# EAGLE schematic controller11_2 (EAGLE 9.4.1)

## Sheet 1 of 2
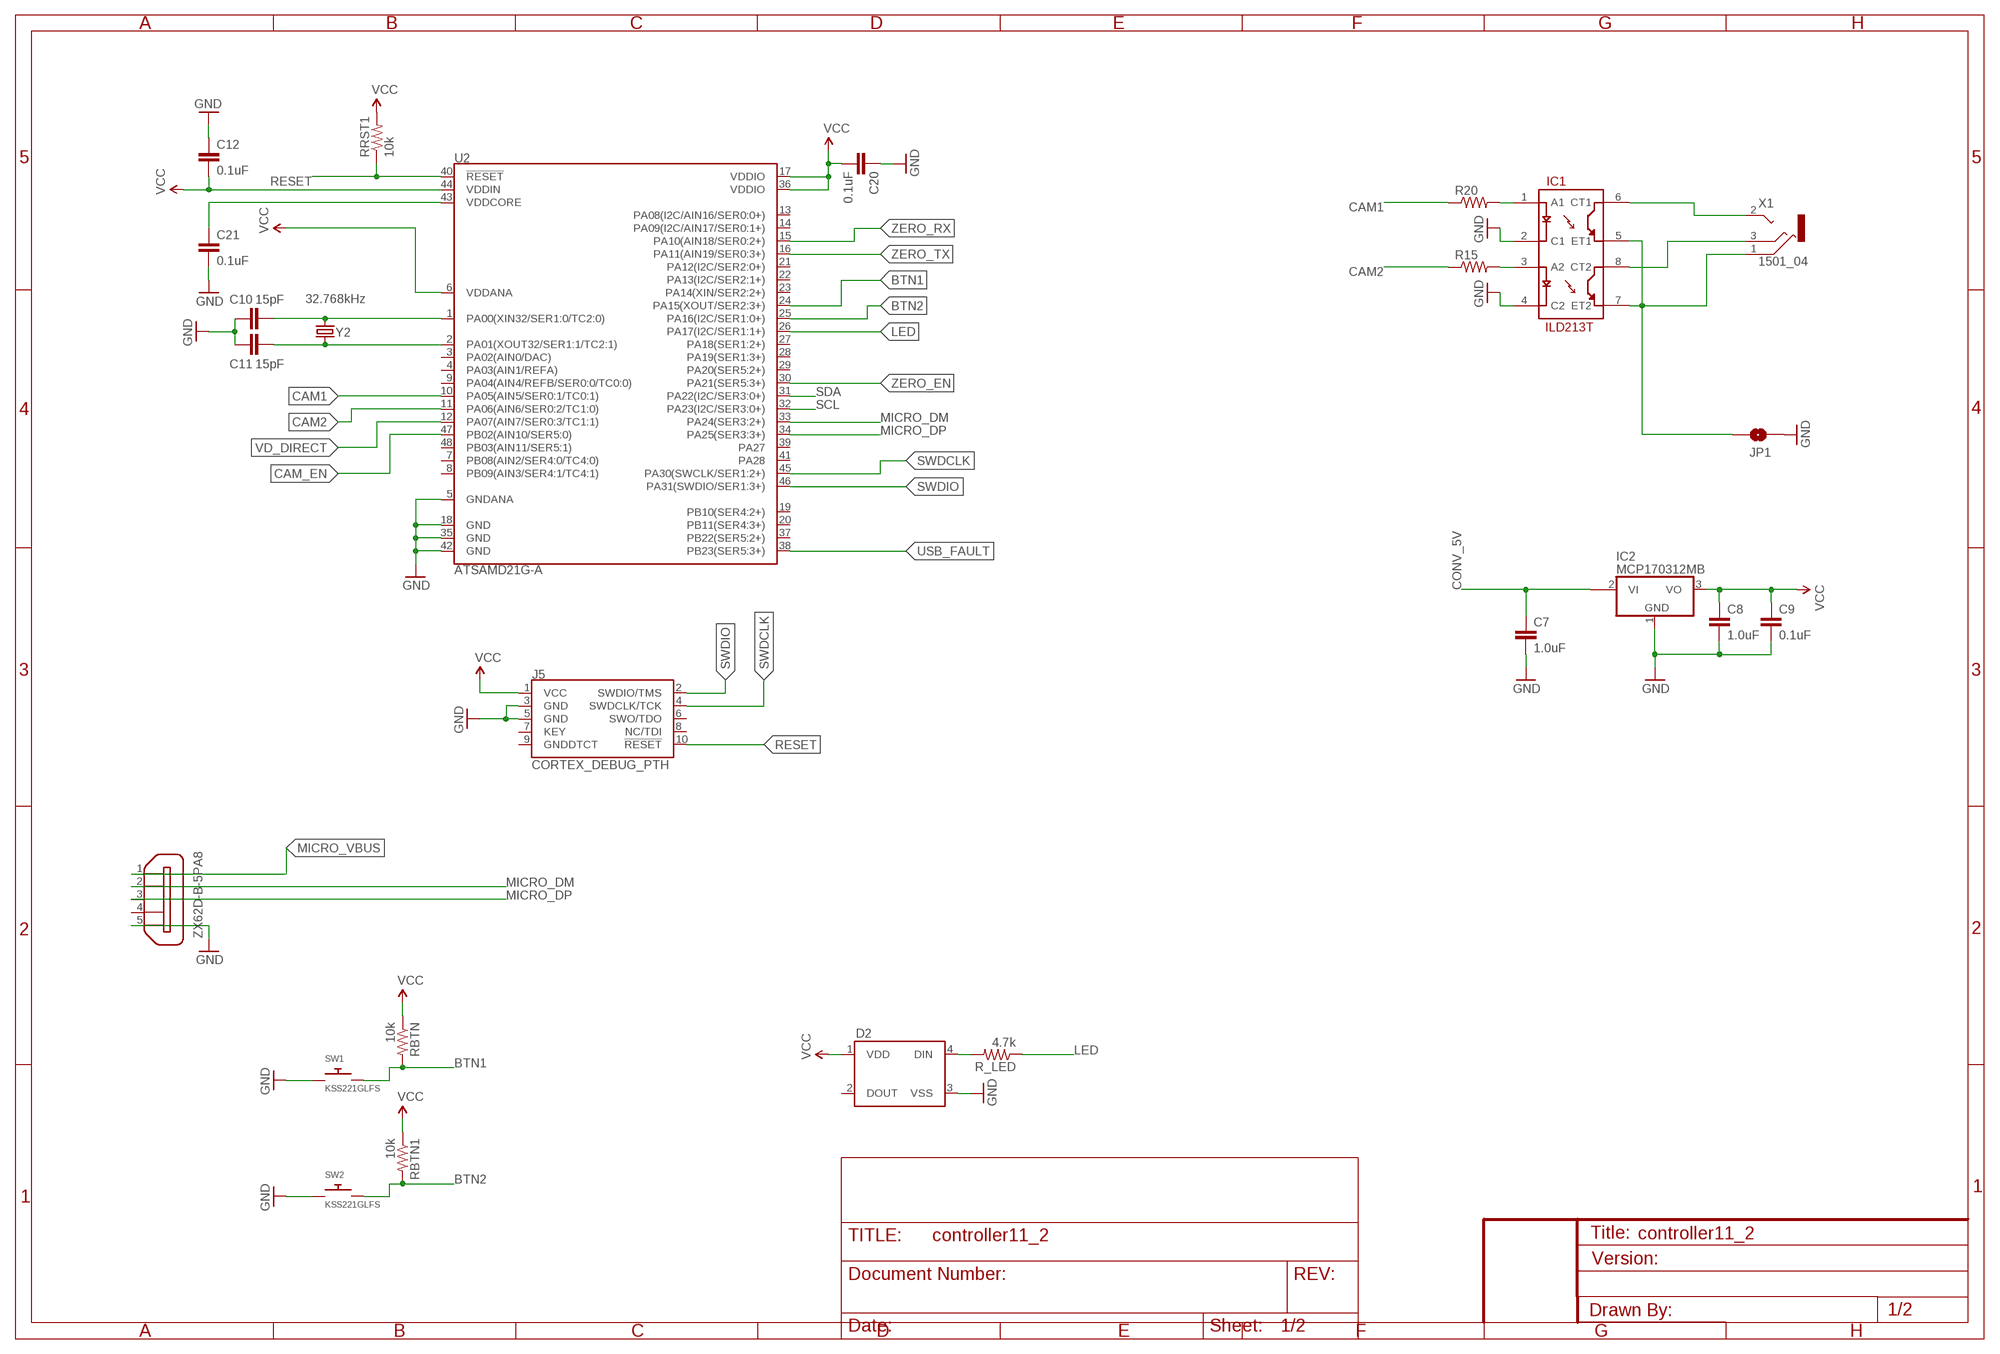
[diagram p0: schematic, sheet 1]

### Parts
C7  1.0uF  1.0UF-0805-25V-10%  [0805]
C8  1.0uF  1.0UF-1206-50V-10%  [1206]
C9  0.1uF  1.0UF-0805-25V-10%  [0805]
C10  15pF  CAP0805  [0805]
C11  15pF  CAP0805  [0805]
C12  0.1uF  1.0UF-0805-25V-10%  [0805]
C20  0.1uF  1.0UF-0805-25V-10%  [0805]
C21  0.1uF  1.0UF-0805-25V-10%  [0805]
D2  WS2812B  [WS2812B]
IC1  ILD213T  [SO08]
IC2  MCP170312MB  [SOT89]
J5  CORTEX_DEBUG_PTH  [2X5-PTH-1.27MM]
JP1  JUMPER-PAD-2-NOYES_SILK  [PAD-JUMPER-2-NO_YES_SILK]
R15  RESISTOR0805-RES  [0805]
R20  RESISTOR0805-RES  [0805]
R_LED  4.7k  RESISTOR0805-RES  [0805]
RBTN  10k  RESISTOR0805-RES  [0805]
RBTN1  10k  RESISTOR0805-RES  [0805]
RRST1  10k  RESISTOR0805-RES  [0805]
SW1  KSS221GLFS  SWITCH_PUSHBUTTONC&K_KSS  [BTN_CK_KSS]
SW2  KSS221GLFS  SWITCH_PUSHBUTTONC&K_KSS  [BTN_CK_KSS]
U2  ATSAMD21G-A  [TQFP-48]
X1  1501_04  [1501_05]
X2  ZX62D-B-5PA8  [ZX62D-B-5PA8]
Y2  32.768kHz  CRYSTAL3.2X1.5MM  [CRYSTAL-SMD-3.2X1.5MM]

### Nets
BTN1: RBTN.2 SW1.P$2 U2.24(PA15(XOUT/SER2:3+))
BTN2: RBTN1.2 SW2.P$2 U2.25(PA16(I2C/SER1:0+))
CAM1: R20.1 U2.10(PA05(AIN5/SER0:1/TC0:1))
CAM2: R15.1 U2.11(PA06(AIN6/SER0:2/TC1:0))
CAM_EN: U2.47(PB02(AIN10/SER5:0)) ; also sheet 2
CONV_5V [power]: C7.1 IC2.2@1(VI1) ; also sheet 2
GND: C7.2 C8.2 C9.2 C10.1 C11.1 C12.1 C20.1 C21.2 D2.3(VSS) IC1.2(C1) IC1.4(C2) IC2.1(GND) J5.3(GND) J5.5(GND) JP1.1 SW1.P$1 SW2.P$1 U2.5(GNDANA) U2.18(GND) U2.35(GND) U2.42(GND) X2.5 ; also sheet 2
LED: R_LED.1 U2.26(PA17(I2C/SER1:1+))
MICRO_DM: U2.33(PA24(SER3:2+)) X2.2
MICRO_DP: U2.34(PA25(SER3:3+)) X2.3
MICRO_VBUS: X2.1
N$2: C21.1 U2.43(VDDCORE)
N$3: C10.2 U2.1(PA00(XIN32/SER1:0/TC2:0)) Y2.P$2
N$7: D2.4(DIN) R_LED.2
N$12: IC1.6(CT1) X1.2
N$13: IC1.8(CT2) X1.3
N$15: IC1.3(A2) R15.2
N$19: IC1.1(A1) R20.2
N$32: C11.2 U2.2(PA01(XOUT32/SER1:1/TC2:1)) Y2.P$1
N$34: IC1.5(ET1) IC1.7(ET2) JP1.2 X1.1
RESET: J5.10(!RESET) RRST1.1 U2.40(!RESET!)
SCL: U2.32(PA23(I2C/SER3:0+)) ; also sheet 2
SDA: U2.31(PA22(I2C/SER3:0+)) ; also sheet 2
SWDCLK: J5.4(SWDCLK/TCK) U2.45(PA30(SWCLK/SER1:2+))
SWDIO: J5.2(SWDIO/TMS) U2.46(PA31(SWDIO/SER1:3+))
USB_FAULT: U2.38(PB23(SER5:3+))
VCC [power]: C8.1 C9.1 C12.2 C20.2 D2.1(VDD) IC2.3(VO) J5.1(VCC) RBTN1.1 RBTN.1 RRST1.2 U2.6(VDDANA) U2.17(VDDIO) U2.36(VDDIO) U2.44(VDDIN) ; also sheet 2
VD_DIRECT: U2.12(PA07(AIN7/SER0:3/TC1:1)) ; also sheet 2
ZERO_EN: U2.30(PA21(SER5:3+)) ; also sheet 2
ZERO_RX [tiny]: U2.15(PA10(AIN18/SER0:2+)) ; also sheet 2
ZERO_TX [tiny]: U2.16(PA11(AIN19/SER0:3+)) ; also sheet 2
Unconnected: D2.2(DOUT) IC2.2(VI) J5.6(SWO/TDO) J5.7(KEY) J5.8(NC/TDI) J5.9(GNDDTCT) U2.3(PA02(AIN0/DAC)) U2.4(PA03(AIN1/REFA)) U2.7(PB08(AIN2/SER4:0/TC4:0)) U2.8(PB09(AIN3/SER4:1/TC4:1)) U2.9(PA04(AIN4/REFB/SER0:0/TC0:0)) U2.13(PA08(I2C/AIN16/SER0:0+)) U2.14(PA09(I2C/AIN17/SER0:1+)) U2.19(PB10(SER4:2+)) U2.20(PB11(SER4:3+)) U2.21(PA12(I2C/SER2:0+)) U2.22(PA13(I2C/SER2:1+)) U2.23(PA14(XIN/SER2:2+)) U2.27(PA18(SER1:2+)) U2.28(PA19(SER1:3+)) U2.29(PA20(SER5:2+)) U2.37(PB22(SER5:2+)) U2.39(PA27) U2.41(PA28) U2.48(PB03(AIN11/SER5:1)) X2.4 X2.S1 X2.S2 X2.S3 X2.S4

## Sheet 2 of 2
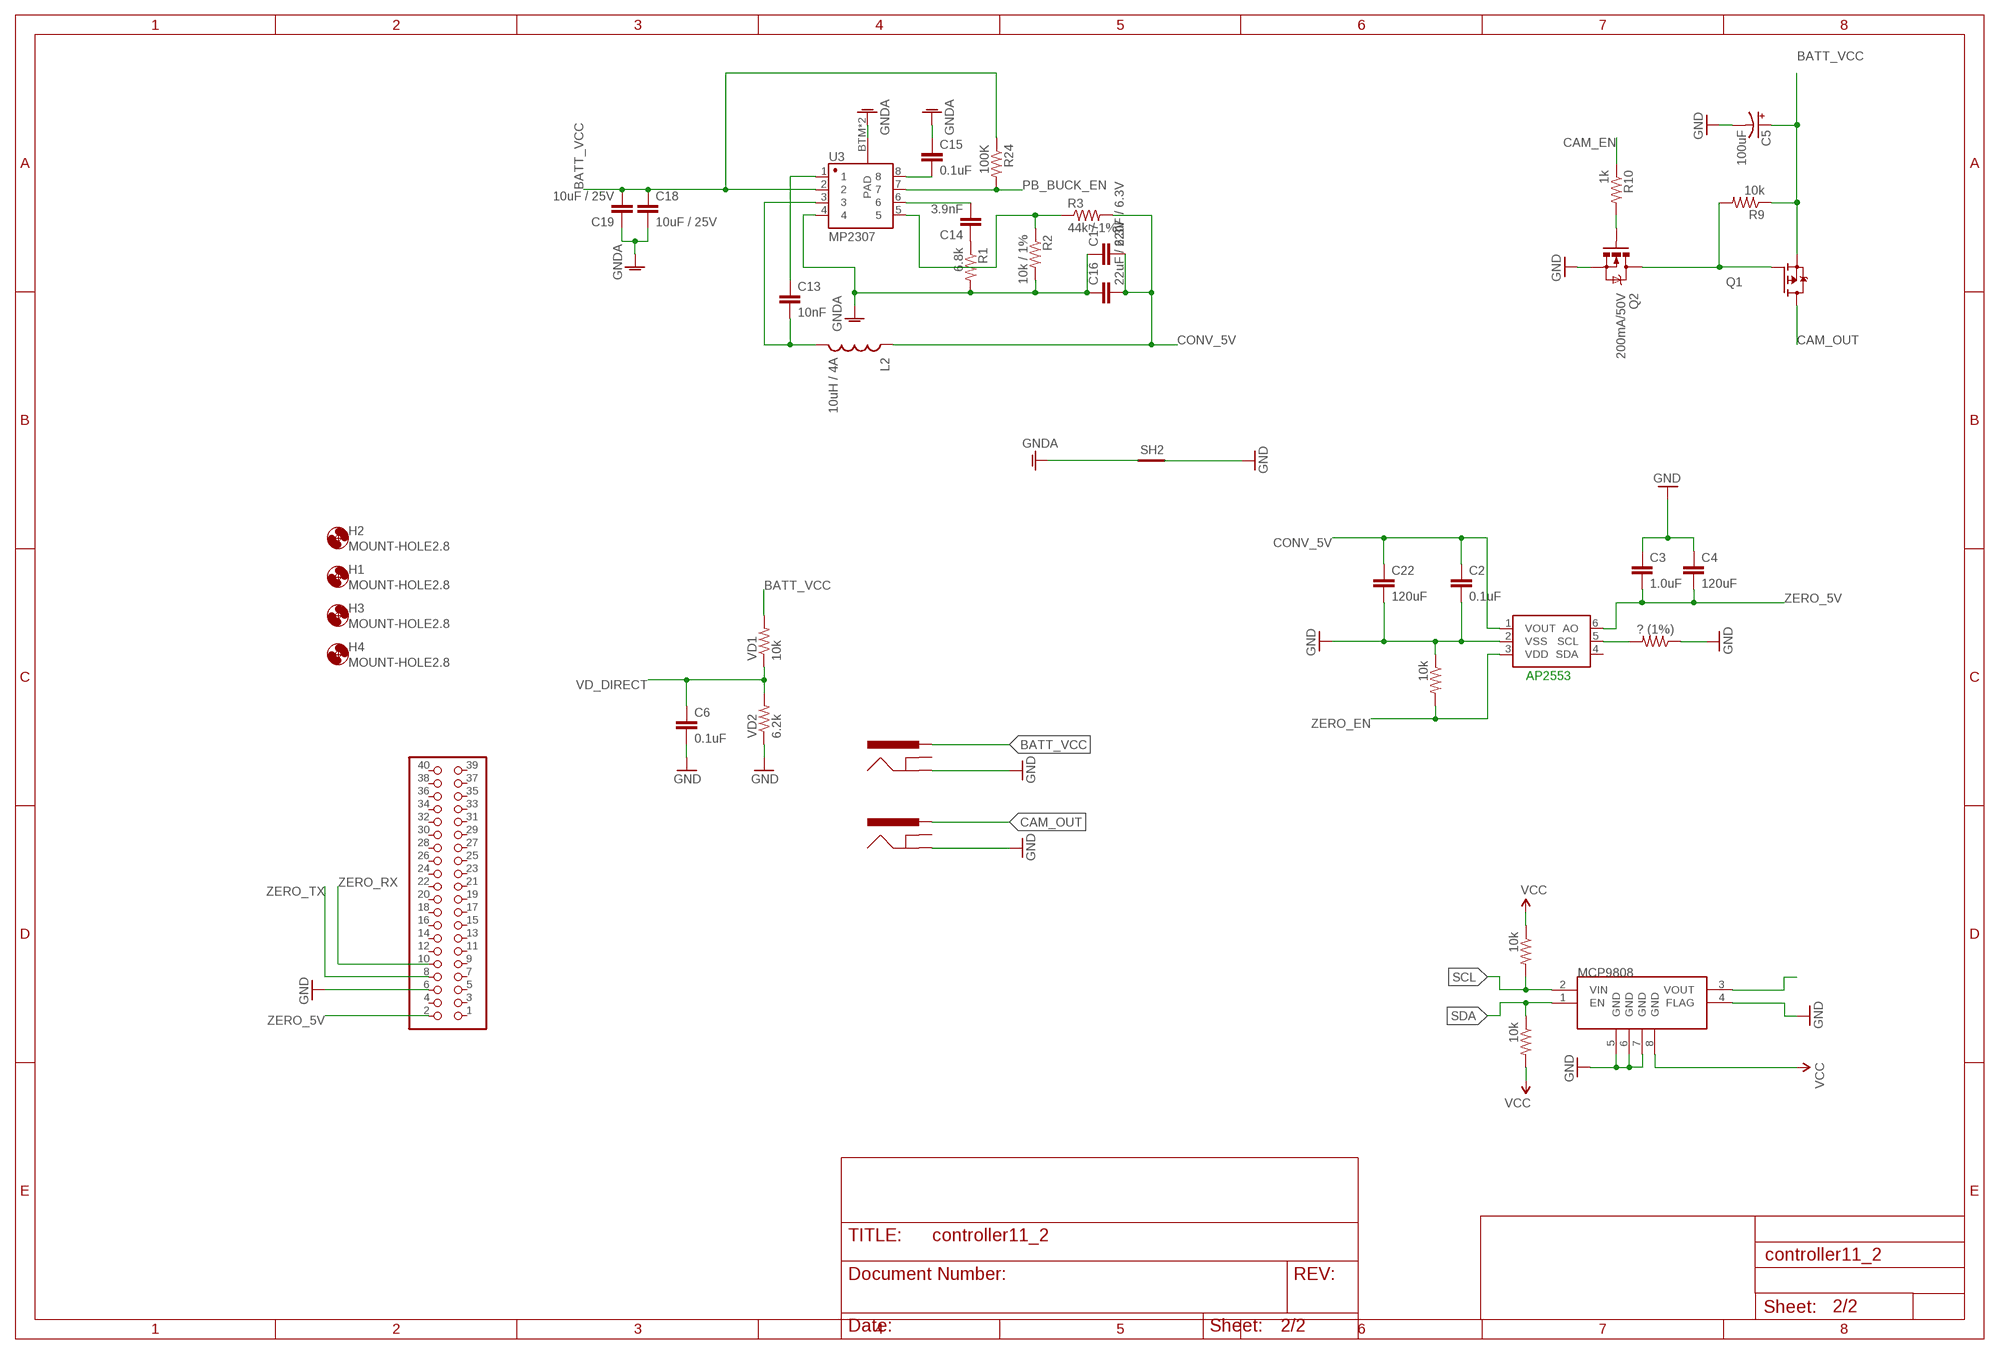
[diagram p1: schematic, sheet 2]

### Parts
AP2553  MCP4725  MCP4725SOT-23  [SOT23-6]
C2  0.1uF  1.0UF-0805-25V-10%  [0805]
C3  1.0uF  1.0UF-0805-25V-10%  [0805]
C4  120uF  1.0UF-1206-50V-10%  [1206]
C5  100uF  100UF-POLAR-25V-20%(ELEC)  [PANASONIC_D]
C6  0.1uF  CAP1206  [1206]
C13  10nF  CAP1206  [1206]
C14  3.9nF  CAP1206  [1206]
C15  0.1uF  CAP1206  [1206]
C16  22uF / 6.3V  CAP1210  [1210]
C17  22uF / 6.3V  CAP1210  [1210]
C18  10uF / 25V  CAP1210  [1210]
C19  10uF / 25V  CAP1210  [1210]
C22  120uF  1.0UF-1206-50V-10%  [1206]
H1  MOUNT-HOLE2.8  [2,8]
H2  MOUNT-HOLE2.8  [2,8]
H3  MOUNT-HOLE2.8  [2,8]
H4  MOUNT-HOLE2.8  [2,8]
J1  POWER_JACKPTH_BREAD  [POWER_JACK_PTH_BREAD]
J2  POWER_JACKPTH_BREAD  [POWER_JACK_PTH_BREAD]
JP2  PINHD-2X20  [2X20]
L2  10uH / 4A  INDUCTORSRU1038  [SRU1038]
MCP9808  V_REG_MIC5216  [MSOP8]
Q1  FDD4141TO252  [TO252]
Q2  200mA/50V  MOSFET-NCHANNELBSS138  [SOT23-3]
R1  6.8k  RESISTOR1206  [1206]
R2  10k / 1%  RESISTOR1206  [1206]
R3  44k / 1%  RESISTOR1206  [1206]
R9  10k  RESISTOR0805-RES  [0805]
R10  1k  RESISTOR0805-RES  [0805]
R24  100K  RESISTOR1206  [1206]
R_I2C_1  10k  RESISTOR0805-RES  [0805]
R_I2C_2  10k  RESISTOR0805-RES  [0805]
R_MOSFET_USB1  ? (1%)  RESISTOR0805-RES  [0805]
R_MOSFET_USB3  10k  RESISTOR0805-RES  [0805]
SH2  SHORT-HT5  [SHORT_TOP-50]
U3  MP2307  GENERIC-SOIC8MSGEQ7N-FILTER  [SO08]
VD1  10k  RESISTOR1206  [1206]
VD2  6.2k  RESISTOR1206  [1206]

### Nets
BATT_VCC [camera_power]: C5.+ C18.1 C19.2 J1.PWR Q1.2(S) R9.1 R24.1 U3.2 VD1.2
CAM_EN: R10.1 ; also sheet 1
CAM_OUT [camera_power]: J2.PWR Q1.3(D)
CONV_5V [power]: AP2553.1(VOUT) C2.1 C16.2 C17.2 C22.1 L2.1 R3.2 ; also sheet 1
GND: AP2553.2(VSS) C2.2 C3.1 C4.1 C5.- C6.2 C22.2 J1.GND J2.GND JP2.6 MCP9808.4(FLAG) MCP9808.5(GND) MCP9808.6(GND) MCP9808.7(GND) Q2.2(S) R_MOSFET_USB1.1 R_MOSFET_USB3.1 SH2.2 VD2.1 ; also sheet 1
GNDA [power]: C15.1 C16.1 C17.1 C18.2 C19.1 R1.2 R2.2 SH2.1 U3.4 U3.BTM(PAD) U3.P$1(PAD)
N$1: Q1.1(G) Q2.3(D) R9.2
N$4: AP2553.5(SCL) R_MOSFET_USB1.2
N$5: MCP9808.3(VOUT)
N$6: Q2.1(G) R10.2
N$25: C15.2 U3.8
N$26 [power]: C13.2 L2.2 U3.3
N$27: C13.1 U3.1
N$28: C14.1 R1.1
N$29: C14.2 U3.6
N$30: R2.1 R3.1 U3.5
PB_BUCK_EN: R24.2 U3.7
SCL: MCP9808.2(VIN) R_I2C_1.2 ; also sheet 1
SDA: MCP9808.1(EN) R_I2C_2.1 ; also sheet 1
VCC [power]: MCP9808.8(GND) R_I2C_1.1 R_I2C_2.2 ; also sheet 1
VD_DIRECT: C6.1 VD1.1 VD2.2 ; also sheet 1
ZERO_5V [power]: AP2553.6(AO) C3.2 C4.2 JP2.2
ZERO_EN: AP2553.3(VDD) R_MOSFET_USB3.2 ; also sheet 1
ZERO_RX [tiny]: JP2.10 ; also sheet 1
ZERO_TX [tiny]: JP2.8 ; also sheet 1
Unconnected: AP2553.4(SDA) J1.GNDBREAK J2.GNDBREAK JP2.1 JP2.3 JP2.4 JP2.5 JP2.7 JP2.9 JP2.11 JP2.12 JP2.13 JP2.14 JP2.15 JP2.16 JP2.17 JP2.18 JP2.19 JP2.20 JP2.21 JP2.22 JP2.23 JP2.24 JP2.25 JP2.26 JP2.27 JP2.28 JP2.29 JP2.30 JP2.31 JP2.32 JP2.33 JP2.34 JP2.35 JP2.36 JP2.37 JP2.38 JP2.39 JP2.40

### Notes on the sheet
- AP2553

## Library data of the parts
AP2553 = SparkFun-IC-Conversion:MCP4725: MCP4725 DAC Microchip 12-bit I2C DAC, SOT23-6 Datasheet <https://cdn.sparkfun.com/datasheets/BreakoutBoards/MCP4725_2009.pdf> SparkFun Products SparkFun I2C DAC Breakout - MCP4725 <https://www.sparkfun.com/products/12918> (BOB-12918); PROD_ID: IC-08886
C2 C9 C12 C20 C21 = SparkFun-Capacitors:1.0UF: 1µF ceramic capacitors A capacitor is a passive two-terminal electrical component used to store electrical energy temporarily in an electric field.; PROD_ID: CAP-08064; VALUE: 1.0uF
C3 C7 = SparkFun-Capacitors:1.0UF: 1µF ceramic capacitors A capacitor is a passive two-terminal electrical component used to store electrical energy temporarily in an electric field.; PROD_ID: CAP-08064
C4 C22 = SparkFun-Capacitors:1.0UF: 1µF ceramic capacitors A capacitor is a passive two-terminal electrical component used to store electrical energy temporarily in an electric field.; PROD_ID: CAP-09822; VALUE: 1.0uF
C5 = SparkFun-Capacitors:100UF-POLAR: 100µF polarized capacitors A capacitor is a passive two-terminal electrical component used to store electrical energy temporarily in an electric field.; PROD_ID: CAP-12547
C6 C13-C19 = SparkFun-Capacitors:CAP: Capacitor Standard 0603 ceramic capacitor, and 0.1" leaded capacitor.
C8 = SparkFun-Capacitors:1.0UF: 1µF ceramic capacitors A capacitor is a passive two-terminal electrical component used to store electrical energy temporarily in an electric field.; PROD_ID: CAP-09822
C10 C11 = SparkFun-Passives:CAP: Capacitor Standard 0603 ceramic capacitor, and 0.1" leaded capacitor.
D2 = SparkFun-LED:WS2812B: WS2812B - Intelligent control LED integrated light source Technical Specifications: Power Supply Voltage (VDD): 3.5 to 5.3 V Input Voltage (VI): -0.5 to VDD+0.5 V Operating Junction Temperature (Topt): -25°C to +80°C Storage Temperature Range (Tstg): -55°C to +150°C; PROD_ID: DIO-12503
H1-H4 = holes:MOUNT-HOLE: MOUNTING HOLE with drill center marker
IC1 = SparkFun-DiscreteSemi:ILD213T: Dual optoisolator.
IC2 = linear:MCP1703*: 250 mA, 16V, Low Quiescent Current LDO Regulator Source: http://ww1.microchip.com/downloads/en/DeviceDoc/22049b.pdf
J1 J2 = SparkFun-Connectors:POWER_JACK: Power Jack Connector This is the standard 5.5mm barrel jack for power. The PTH is the most common, proven, reliable, footprint. The Slot footprint only works if the mill layer is transmitted to the PCB fab house so be warned. Here are the connectors we sell at SparkFun: DC Barrel Power Jack/Connector <https://www.sparkfun.com/products/119> (PRT-00119) DC Barrel Power Jack/Connector (SMD) <https://www.sparkfun.com/products/12748> (PRT-12748) DC Barrel Jack Adapter - Breadboard Compatible <https://www.sparkfun.com/products/10811> (PRT-10811) It is used on this SparkFun product (and many, many others): SparkFun RedBoard - Programmed with Arduino <https://www.sparkfun.com/products/12757> (DEV-12757) Also, if you need a mating power supply or connector, please check these out: Wall Adapter Power Supply - 9VDC 650mA <https://www.sparkfun.com/products/298> (TOL-00298) DC Barrel Jack Adapter - Male <https://www.sparkfun.com/products/10287> (PRT-10287); PROD_ID: PRT-10811
J5 = SparkFun-Connectors:CORTEX_DEBUG: Cortex Debug Connector - 10 pin Supports JTAG debug, Serial Wire debug, and Serial Wire Viewer. PTH and SMD connector options available. General Connector Information <http://infocenter.arm.com/help/topic/com.arm.doc.faqs/attached/13634/cortex_debug_connectors.pdf> Products: PTH Connector <http://www.digikey.com/product-detail/en/cnc-tech/3220-10-0100-00/1175-1627-ND/3883661> -via Digi-Key SparkFun PSoc <https://www.sparkfun.com/products/13229> SparkFun T <https://www.sparkfun.com/products/13810>
JP1 = SparkFun-Passives:JUMPER-PAD-2-NO
JP2 = adafruit:PINHD-2X20: PIN HEADER
L2 = SparkFun-Passives:INDUCTOR: Inductors Basic Inductor/Choke - 0603 and 1206. Footprints are not proven and vary greatly between part numbers. INDUCTOR POWER 3.3UH 4.0A SMD 0.197" L x 0.197" W x 0.177" H (5.00mm x 5.00mm x 4.50mm)
MCP9808 = SparkFun-IC-Power:V_REG_MIC5216: 500mA LDO, MSOP8 for better dissipation; PROD_ID: IC-09527
Q1 = transistor-fet:FDD4141: P-Channel PowerTrench® MOSFET Source: FDD4141.pdf
Q2 = SparkFun-DiscreteSemi:MOSFET-NCHANNEL: Common NMOSFET Parts MFG P/N Store ID Prod ID FDD8780 TRANS-09984 SI7820DN TRANS-11055 FDS6630A IC-08089 2N7002PW TRANS-11151 FQP30N06L COM-10213 TRANS-10060 BSS123LT1G TRANS-08345 BSS138 TRANS-00830 BS170 2N7000; PROD_ID: TRANS-00830
R1-R3 R9 R10 R24 R_LED = SparkFun-Resistors:RESISTOR: Resistor Basic schematic elements and footprints for 0603, 1206, and PTH resistors.
R15 R20 R_I2C_1 R_I2C_2 R_MOSFET_USB1 R_MOSFET_USB3 RBTN RBTN1 RRST1 VD1 VD2 = SparkFun-Passives:RESISTOR: Resistor Basic schematic elements and footprints for 0603, 1206, and PTH resistors.
SH2 = shorts:SHORT-H: Short between two nets; BOM: no
SW1 SW2 = adafruit:SWITCH_PUSHBUTTON: Buttons SOFTTOUCHSMD_SJ - Soft touch temporary push button (Super Junk Akihabara) Compatible with SKPMANE010 [Mouser: 688-SKPMAN] C&K_KSS = Digikey: KSS221GLFS
U2 = SparkFun-IC-Microcontroller:ATSAMD21G: Atmel SAMD21G SMART ARM-Based Microcontroller The Atmel ® | SMART ™ SAM D21 is a series of low-power microcontrollers using the 32-bit ARM ® Cortex ® -M0+ processor, and ranging from 32- to 64-pins with up to 256KB Flash and 32KB of SRAM. The SAM D21 devices operate at a maximum frequency of 48MHz and reach 2.46 CoreMark/MHz. They are designed for simple and intuitive migration with identical peripheral modules, hex compatible code, identical linear address map and pin compatible migration paths between all devices in the product series. All devices include intelligent and flexible peripherals, Atmel Event System for inter-peripheral signaling, and support for capacitive touch button, slider and wheel user interfaces. Datasheet <https://cdn.sparkfun.com/datasheets/Dev/Arduino/Boards/Atmel-42181-SAM-D21_Datasheet.pdf> SparkFun Products SparkFun SAMD21 Mini Breakout <https://www.sparkfun.com/products/13664> (DEV-13664) SparkFun SAMD21 Dev Breakout <https://www.sparkfun.com/products/13672> (DEV-13672); PROD_ID: IC-13064
U3 = SparkFun-AnalogIC:GENERIC-SOIC8: A placeholder for generic narrow & wide SOIC8 foorptints - used on the DIP adapter board.; PROD_ID: IC-10141
X1 = con-lumberg:1501_0*: Jack connectors according to JISC 6560, 2.5 mm Klinkensteckverbinder nach JISC 6560, 2,5 mm Source: http://www.lumberg.com/Produkte/PDFs/1501_05.pdfedit 1501_03 http://www.lumberg.com/Produkte/PDFs/1501_06.pdf; OC_FARNELL: 1216977; OC_NEWARK: unknown
X2 = zx62d-b-5pa8-oshpark_10:ZX62D-B-5PA8: Micro USB Type B Connector - Standard, Shell Through Hole Source: http://www.hirose.co.jp/cataloge_hp/ed_ZX_20140804.pdf; MF: Hirose; MPN: ZX62D-B-5PA8; OC_FARNELL: 2300438; OC_NEWARK: 69W0712
Y2 = samd21-temp:CRYSTAL: Various standard crystals. Proven footprints.; PROD_ID: XTAL-13062

## Net classes
0 default: width 0.254 mm, clearance 0.254 mm
1 power: width 0.254 mm, clearance 0.254 mm
2 camera_power: width 0.66 mm, clearance 0.381 mm
3 usbsignal: width 0.254 mm, clearance 0.203 mm
4 highpower: clearance 0.305 mm
5 tiny: width 0.178 mm, clearance 0.178 mm